# Altium schematic sheet Filter_Section.SchDoc
size A3; DocumentNumber: 5; SheetNumber: 5; SheetTotal: 6
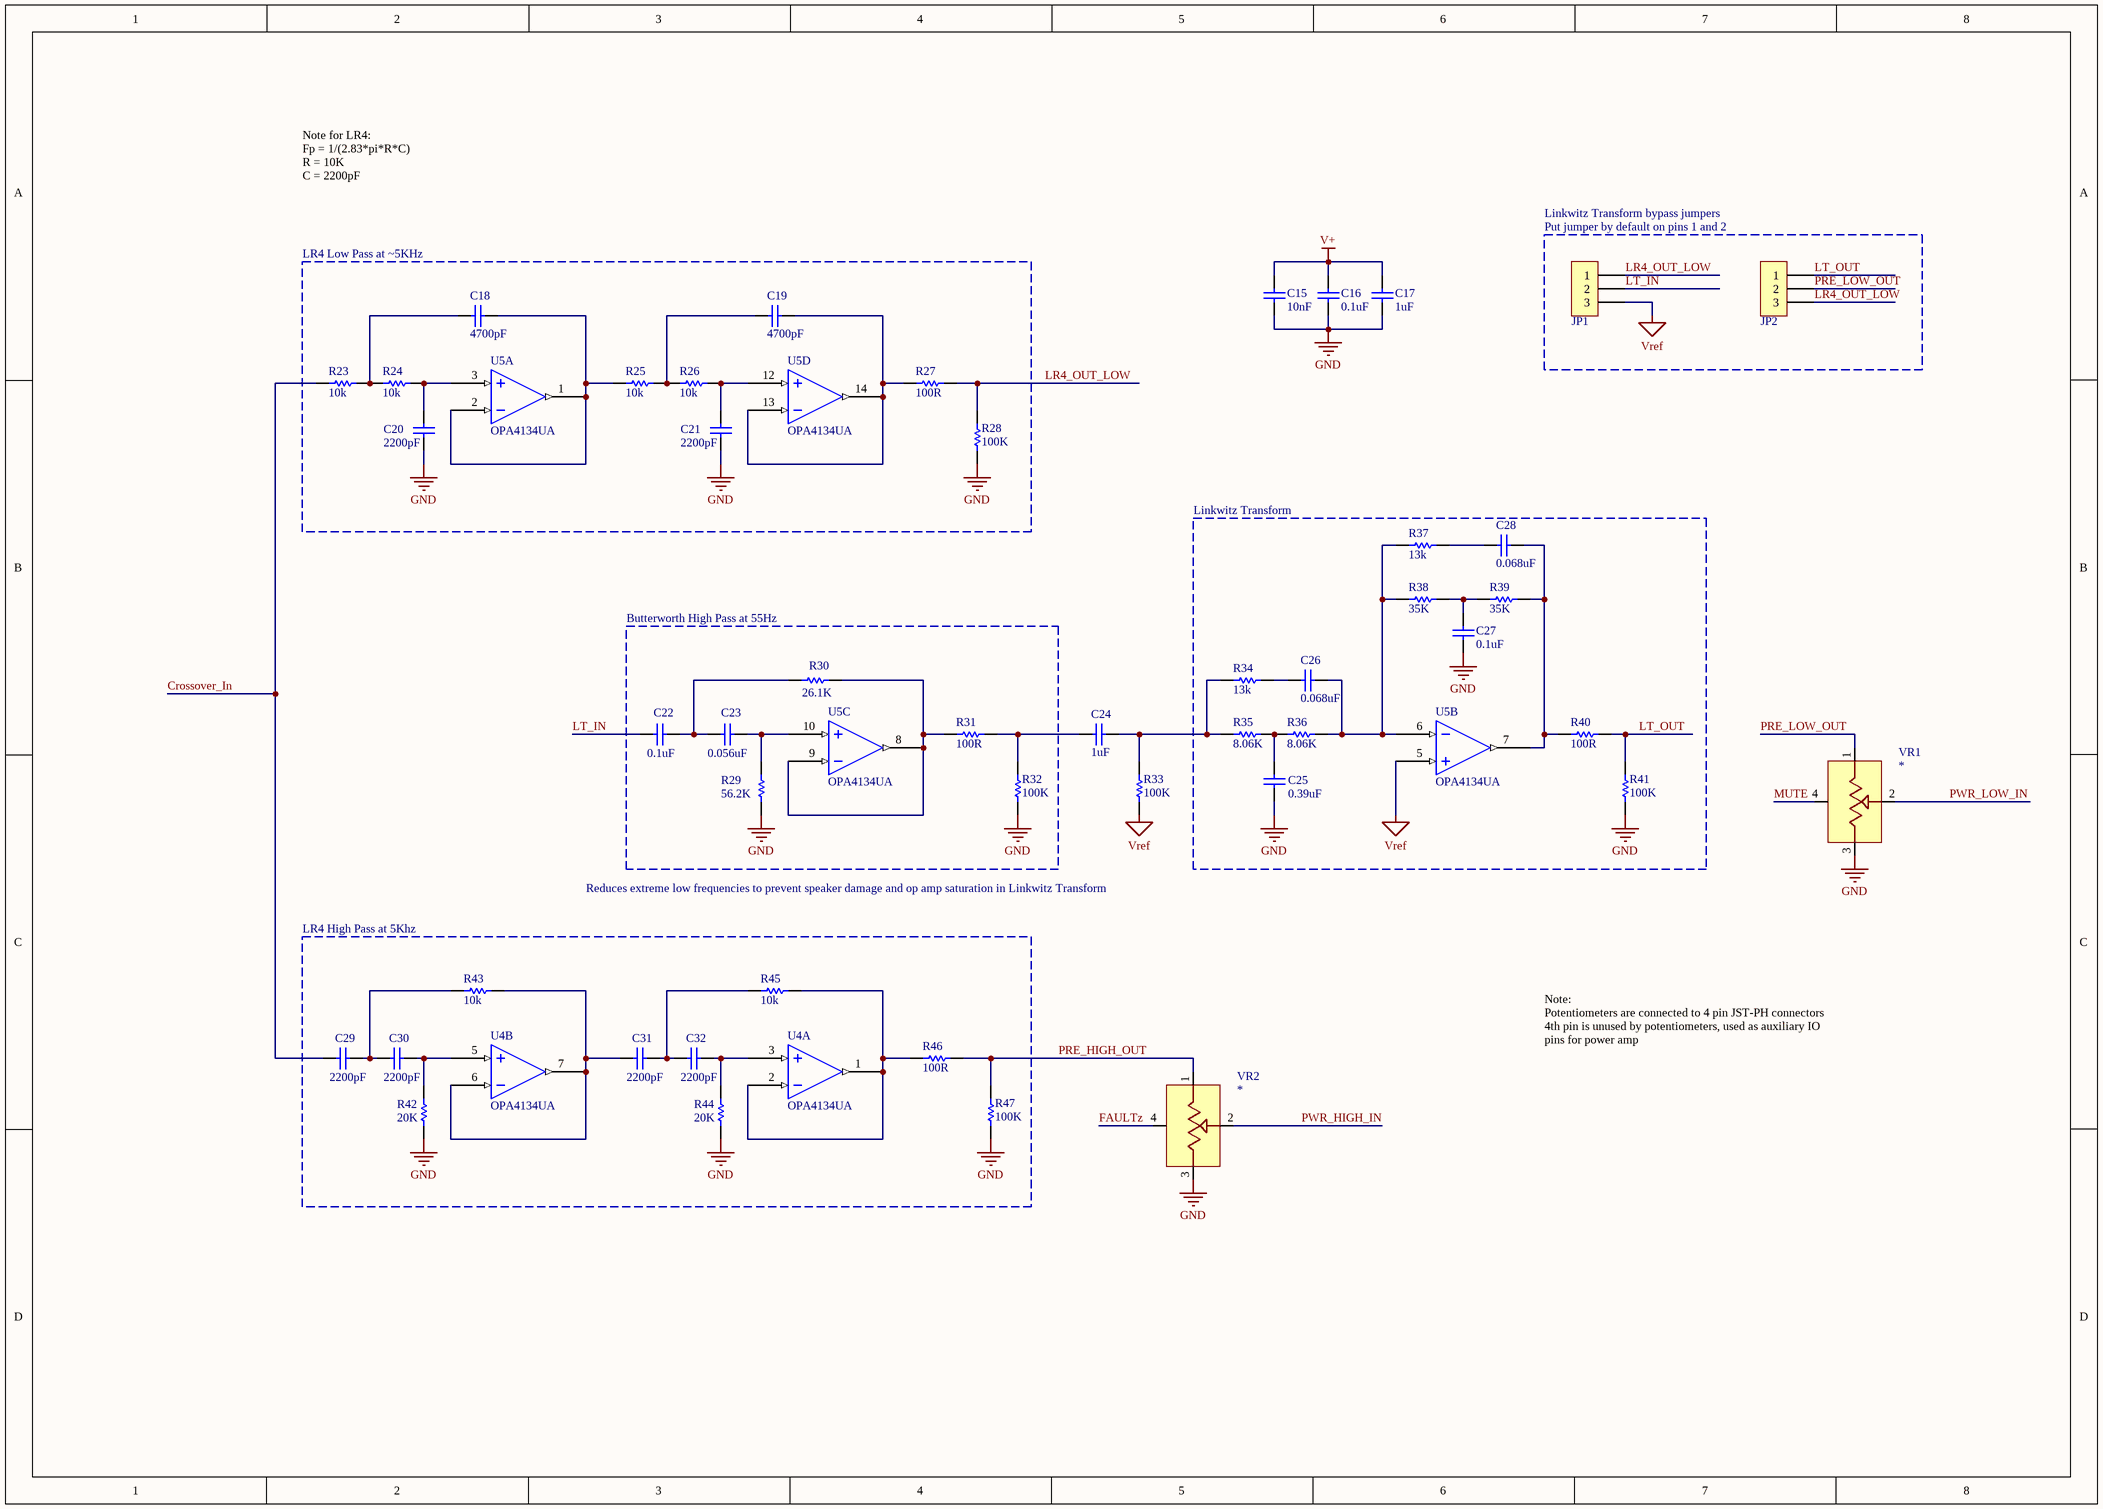
[diagram p0: Filter_Section.SchDoc]

## Parts
C15  10nF  [CAPC1608X09N]
C16  0.1uF  [CAPC1608X09N]
C17  1uF  [CAPC1608X09N]
C18  4700pF  [CAPC1608X09N]
C19  4700pF  [CAPC1608X09N]
C20  2200pF  [CAPC1608X09N]
C21  2200pF  [CAPC1608X09N]
C22  0.1uF  [CAPC3216X18N]
C23  0.056uF  [CAPC3216X18N]
C24  1uF  [CAP Radial 5mm]
C25  0.39uF  [CAP Radial 5mm]
C26  0.068uF  [CAPC3216X18N]
C27  0.1uF  [CAPC3216X18N]
C28  0.068uF  [CAPC3216X18N]
C29  2200pF  [CAPC1608X09N]
C30  2200pF  [CAPC1608X09N]
C31  2200pF  [CAPC1608X09N]
C32  2200pF  [CAPC1608X09N]
JP1  JUMPER 3POS THRU HOLE 2.54MM  [3 Position 2.54MM Thru-Hole]  (value not drawn)
JP2  JUMPER 3POS THRU HOLE 2.54MM  [3 Position 2.54MM Thru-Hole]  (value not drawn)
R23  10k  [RESC1608X06N]
R24  10k  [RESC1608X06N]
R25  10k  [RESC1608X06N]
R26  10k  [RESC1608X06N]
R27  100R  [RESC1608X06N]
R28  100K  [RESC1608X06N]
R29  56.2K  [RESC1608X06N]
R30  26.1K  [RESC1608X06N]
R31  100R  [RESC1608X06N]
R32  100K  [RESC1608X06N]
R33  100K  [RESC1608X06N]
R34  13k  [RESC1608X06N]
R35  8.06K  [RESC1608X06N]
R36  8.06K  [RESC1608X06N]
R37  13k  [RESC1608X06N]
R38  35K  [RESC1608X06N]
R39  35K  [RESC1608X06N]
R40  100R  [RESC1608X06N]
R41  100K  [RESC1608X06N]
R42  20K  [RESC1608X06N]
R43  10k  [RESC1608X06N]
R44  20K  [RESC1608X06N]
R45  10k  [RESC1608X06N]
R46  100R  [RESC1608X06N]
R47  100K  [RESC1608X06N]
U4  OPA4134UA  [SOIC127P600X175-14N]  (parts A,B of 4)
U5  OPA4134UA  [SOIC127P600X175-14N]  (parts A,B,C,D of 4)
VR1  *  [JST PH-4]
VR2  *  [JST PH-4]

## Blocks framed on the sheet
LR4 Low Pass at ~5KHz: C18-C21 R23-R28 U5
Linkwitz Transform: C25-C28 R34-R41 U5
Butterworth High Pass at 55Hz: C22 C23 R29-R32 U5
LR4 High Pass at 5Khz: C29-C32 R42-R47 U4

## Nets
GND: C15.1 C16.1 C17.2 C20.1 C21.1 C25.1 C27.2 R28.1 R29.1 R32.1 R41.1 R42.1 R44.2 R47.1 U5.11(V-) VR1.3(B) VR2.3(B)
V+: C15.2 C16.2 C17.1 U4.4(V+) U5.4(V+)
Vref: JP1.3 R33.1 U5.5(+In_B)
Crossover_In: C29.1 R23.1
FAULTz: VR2.4
LR4_OUT_LOW: JP1.1 JP2.3 R27.2 R28.2
LT_IN: C22.1 JP1.2
LT_OUT: JP2.1 R40.2 R41.2
MUTE: VR1.4
PRE_HIGH_OUT: R46.2 R47.2 VR2.1(A)
PRE_LOW_OUT: JP2.2 VR1.1(A)
PWR_HIGH_IN: VR2.2(W)
PWR_LOW_IN: VR1.2(W)
NetC18_1: C18.1 R23.2 R24.1
NetC18_2: C18.2 R25.1 U5.1(Out_A) U5.2(-In_A)
NetC19_1: C19.1 R25.2 R26.1
NetC19_2: C19.2 R27.1 U5.13(-In_D) U5.14(Out_D)
NetC20_2: C20.2 R24.2 U5.3(+In_A)
NetC21_2: C21.2 R26.2 U5.12(+In_D)
NetC22_2: C22.2 C23.1 R30.1
NetC23_2: C23.2 R29.2 U5.10(+In_C)
NetC24_1: C24.1 R31.2 R32.2
NetC24_2: C24.2 R33.2 R34.1 R35.1
NetC25_2: C25.2 R35.2 R36.1
NetC26_1: C26.1 R34.2
NetC26_2: C26.2 R36.2 R37.1 R38.1 U5.6(-In_B)
NetC27_1: C27.1 R38.2 R39.1
NetC28_1: C28.1 R37.2
NetC28_2: C28.2 R39.2 R40.1 U5.7(Out_B)
NetC29_2: C29.2 C30.1 R43.1
NetC30_2: C30.2 R42.2 U4.5(+In_B)
NetC31_1: C31.1 R43.2 U4.6(-In_B) U4.7(Out_B)
NetC31_2: C31.2 C32.1 R45.1
NetC32_2: C32.2 R44.1 U4.3(+In_A)
NetR30_2: R30.2 R31.1 U5.8(Out_C) U5.9(-In_C)
NetR45_2: R45.2 R46.1 U4.1(Out_A) U4.2(-In_A)

## Notes on the sheet
- Note for LR4:
  Fp = 1/(2.83*pi*R*C)
  R = 10K
  C = 2200pF
  Fp = 5112.6Hz
- Linkwitz Transform bypass jumpers
- Put jumper by default on pins 1 and 2
- Reduces extreme low frequencies to prevent speaker damage and op amp saturation in Linkwitz Transform
- Note:
  Potentiometers are connected to 4 pin JST-PH connectors
  4th pin is unused by potentiometers, used as auxiliary IO pins for power amp

## Library data of the parts
C15 = CAP CER 10nF 0603: Bypass caps; Manufacturer: Murata; Value: 10nF; Digikey Part Number: 490-9666-1-ND
C16 = CAP CER 0.1uF 0603: Voltage: 50V; Rating: X7R; Tolerance: 10%; Value: 0.1uF; Digikey Part Number: 490-1519-1-ND; Package: 0603
C17 = CAP CER 1uF 0603: Manufacturer: Murata; Manufacturer Part Number: GRM188R7YA105KA12D; Voltage: 35V; Rating: X7R; Tolerance: 10%; Value: 1uF; Digikey Part Number: 490-10487-1-ND
C18 C19 = CAP CER 4700pF 0603: Manufacturer: TDK; Voltage: 100V; Tolerance: 5%; Rating: C0G; Value: 4700pF; Digikey Part Number: 445-172684-1-ND
C20 C21 C29-C32 = CAP CER 2200pF 0603: Manufacturer: Murata; Voltage: 50V; Tolerance: 1%; Rating: C0G; Value: 2200pF; Digikey Part Number: 490-7768-1-ND
C22 C27 = CAP CER 0.1uF C0G 1206: Voltage: 25V; Rating: C0G; Tolerance: 5%; Value: 0.1uF; Digikey Part Number: 490-1767-1-ND; Package: 1206
C23 = CAP CER 0.056uF C0G 1206: Voltage: 50V; Rating: C0G; Tolerance: 5%; Value: 0.056uF; Digikey Part Number: 490-8347-1-ND; Package: 1206
C24 = CAP FILM 1uF RADIAL 5MM: Audio coupling cap; Manufacturer: EPCOS (TDK); Manufacturer P/N: B32529C105J; Voltage: 63V; Value: 1uF; Digikey Part Number: 495-1119-ND
C25 = CAP 0.39uF Radial 5mm: Film cap in LT; Manufacturer: EPCOS (TDK); Manufacturer P/N: B32529C105J; Voltage: 63V; Value: 0.39uF; Digikey Part Number: 495-4846-1-ND
C26 C28 = CAP CER 0.068uF 1206: Voltage: 100V; Rating: C0G; Tolerance: 5%; Value: 0.068uF; Digikey Part Number: 445-172693-1-ND; Package: 1206
R23-R26 R43 R45 = RES 10K 0603: Manufacturer: Yageo; Manufacturer Part Number: RC0603FR-0710KL; Tolerance: 1%; Power: 0.1W; Type: RES; Footprint: 0603; Temperature: 155dC; Digikey Part Number: 311-10.0KHRCT-ND; Value: 10k
R27 R31 R40 R46 = RES 100R 0603: Tolerance: 1%; Power: 0.25W; Type: RES; Footprint: 0603; Digikey Part Number: 541-100SACT-ND; Value: 100R
R28 R32 R33 R41 R47 = RES 100K 0603: Tolerance: 1%; Power: 0.1W; Footprint: 0603; Value: 100K; Digikey Part Number: 311-100KHRCT-ND
R29 = RES 56.2K 0603: Manufacturer: Yageo; Manufacturer Part Number: RC0603FR-0756K2L; Tolerance: 1%; Power: 0.1W; Type: RES; Footprint: 0603; Temperature: 155dC; Digikey Part Number: 311-56.2KHRCT-ND; Value: 56.2K
R30 = RES 26.1K 0603: Manufacturer: Yageo; Manufacturer Part Number: RC0603FR-0726K1L; Tolerance: 1%; Power: 0.1W; Type: RES; Footprint: 0603; Temperature: 155dC; Digikey Part Number: 311-26.1KHRCT-ND; Value: 26.1K
R34 R37 = RES 13K 0603: Tolerance: 1%; Type: RES; Footprint: 0603; Value: 13k; Digikey Part Number: 311-13.0KHRCT-ND
R35 R36 = RES 8.06K 0603: Manufacturer: Yageo; Tolerance: 1%; Power: 0.1W; Type: RES; Footprint: 0603; Digikey Part Number: 311-8.06KHRCT-ND; Value: 8.06K
R38 R39 = RES 35K 0603: Tolerance: 1%; Type: RES; Footprint: 0603; Value: 35K; Digikey Part Number: 311-34.8KHRCT-ND
R42 R44 = RES 20K 0603: Tolerance: 1%; Power: 0.1W; Footprint: 0603; Value: 20K; Digikey Part Number: 311-20.0KHRCT-ND
U4 U5 = OPA4134UA: Quad OPAx134 Operational Amplifier; Digikey Part Number: 296-26284-1-ND; Value: OPA4134UA
VR1 VR2 = Potentiometer: Value: *